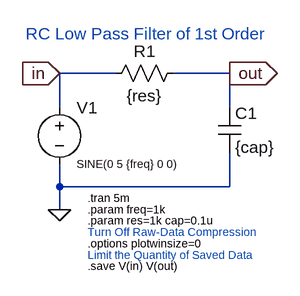
[diagram p0: schematic LowPassFilter.asc]
LowPassFilter.asc, the LTspice schematic file:
Version 4
SHEET 1 880 680
WIRE 128 80 48 80
WIRE 288 80 208 80
WIRE 48 128 48 80
WIRE 288 128 288 80
WIRE 48 240 48 208
WIRE 288 240 288 192
WIRE 288 240 48 240
WIRE 48 272 48 240
FLAG 48 272 0
FLAG 48 80 in
IOPIN 48 80 In
FLAG 288 80 out
IOPIN 288 80 Out
SYMBOL voltage 48 112 R0
WINDOW 3 24 96 Left 1
WINDOW 123 0 0 Left 0
WINDOW 39 0 0 Left 0
SYMATTR Value SINE(0 5 {freq} 0 0)
SYMATTR InstName V1
SYMBOL res 224 64 R90
WINDOW 0 0 56 VBottom 2
WINDOW 3 32 56 VTop 2
SYMATTR InstName R1
SYMATTR Value {res}
SYMBOL cap 272 128 R0
SYMATTR InstName C1
SYMATTR Value {cap}
TEXT 88 256 Left 1 !.tran 5m
TEXT 88 272 Left 1 !.param freq=1k
TEXT 88 288 Left 1 !.param res=1k cap=0.1u
TEXT 88 320 Left 1 !.options plotwinsize=0
TEXT 88 352 Left 1 !.save V(in) V(out)
TEXT 88 304 Left 1 ;Turn Off Raw-Data Compression
TEXT 88 336 Left 1 ;Limit the Quantity of Saved Data
TEXT 0 24 Left 2 ;RC Low Pass Filter of 1st Order

The netlist it stands for:
* LowPassFilter.asc
V1 in 0 SINE(0 5 {freq} 0 0)
R1 out in {res}
C1 out 0 {cap}
.tran 5m
.param freq=1k
.param res=1k cap=0.1u
.options plotwinsize=0
.save V(in) V(out)
* Turn Off Raw-Data Compression
* Limit the Quantity of Saved Data
* RC Low Pass Filter of 1st Order
.backanno
.end